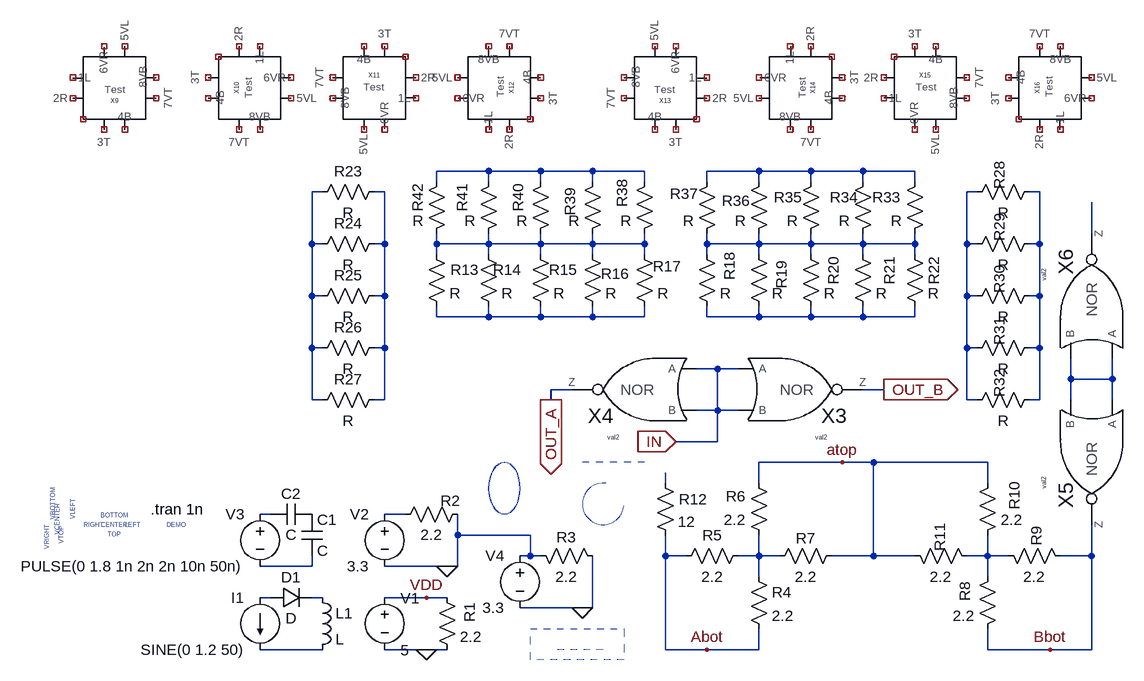
[diagram p0: schematic Draft0.asc]
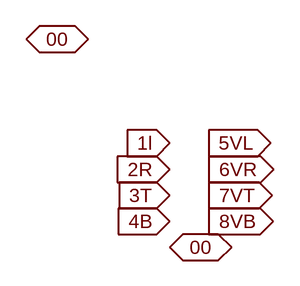
[diagram p1: sub-circuit test.asc]
Draft0.asc, the LTspice schematic file:
Version 4.1
SHEET 1 1832 680
WIRE 848 -144 768 -144
WIRE 928 -144 848 -144
WIRE 1008 -144 928 -144
WIRE 1088 -144 1008 -144
WIRE 1264 -144 1184 -144
WIRE 1344 -144 1264 -144
WIRE 1424 -144 1344 -144
WIRE 1504 -144 1424 -144
WIRE 768 -128 768 -144
WIRE 848 -128 848 -144
WIRE 928 -128 928 -144
WIRE 1008 -128 1008 -144
WIRE 1088 -128 1088 -144
WIRE 1184 -128 1184 -144
WIRE 1264 -128 1264 -144
WIRE 1344 -128 1344 -144
WIRE 1424 -128 1424 -144
WIRE 1504 -128 1504 -144
WIRE 592 -112 576 -112
WIRE 688 -112 672 -112
WIRE 1600 -112 1584 -112
WIRE 1696 -112 1680 -112
WIRE 1776 -48 1776 -96
WIRE 576 -32 576 -112
WIRE 592 -32 576 -32
WIRE 688 -32 688 -112
WIRE 688 -32 672 -32
WIRE 768 -32 768 -48
WIRE 848 -32 848 -48
WIRE 848 -32 768 -32
WIRE 928 -32 928 -48
WIRE 928 -32 848 -32
WIRE 1008 -32 1008 -48
WIRE 1008 -32 928 -32
WIRE 1088 -32 1088 -48
WIRE 1088 -32 1008 -32
WIRE 1184 -32 1184 -48
WIRE 1264 -32 1264 -48
WIRE 1264 -32 1184 -32
WIRE 1344 -32 1344 -48
WIRE 1344 -32 1264 -32
WIRE 1424 -32 1424 -48
WIRE 1424 -32 1344 -32
WIRE 1504 -32 1504 -48
WIRE 1504 -32 1424 -32
WIRE 1584 -32 1584 -112
WIRE 1600 -32 1584 -32
WIRE 1696 -32 1696 -112
WIRE 1696 -32 1680 -32
WIRE 768 -16 768 -32
WIRE 848 -16 848 -32
WIRE 928 -16 928 -32
WIRE 1008 -16 1008 -32
WIRE 1088 -16 1088 -32
WIRE 1184 -16 1184 -32
WIRE 1264 -16 1264 -32
WIRE 1344 -16 1344 -32
WIRE 1424 -16 1424 -32
WIRE 1504 -16 1504 -32
WIRE 576 48 576 -32
WIRE 592 48 576 48
WIRE 688 48 688 -32
WIRE 688 48 672 48
WIRE 1584 48 1584 -32
WIRE 1600 48 1584 48
WIRE 1696 48 1696 -32
WIRE 1696 48 1680 48
WIRE 768 80 768 64
WIRE 848 80 848 64
WIRE 848 80 768 80
WIRE 928 80 928 64
WIRE 928 80 848 80
WIRE 1008 80 1008 64
WIRE 1008 80 928 80
WIRE 1088 80 1088 64
WIRE 1088 80 1008 80
WIRE 1184 80 1184 64
WIRE 1264 80 1264 64
WIRE 1264 80 1184 80
WIRE 1344 80 1344 64
WIRE 1344 80 1264 80
WIRE 1424 80 1424 64
WIRE 1424 80 1344 80
WIRE 1504 80 1504 64
WIRE 1504 80 1424 80
WIRE 576 128 576 48
WIRE 592 128 576 128
WIRE 688 128 688 48
WIRE 688 128 672 128
WIRE 1584 128 1584 48
WIRE 1600 128 1584 128
WIRE 1696 128 1696 48
WIRE 1696 128 1680 128
WIRE 1200 160 1168 160
WIRE 1232 160 1200 160
WIRE 1744 176 1744 144
WIRE 1808 176 1808 144
WIRE 1808 176 1744 176
WIRE 976 192 944 192
WIRE 1456 192 1424 192
WIRE 576 208 576 128
WIRE 592 208 576 208
WIRE 688 208 688 128
WIRE 688 208 672 208
WIRE 944 208 944 192
WIRE 1584 208 1584 128
WIRE 1600 208 1584 208
WIRE 1696 208 1696 128
WIRE 1696 208 1680 208
WIRE 1744 208 1744 176
WIRE 1808 208 1808 176
WIRE 1200 224 1200 160
WIRE 1200 224 1168 224
WIRE 1232 224 1200 224
WIRE 1200 272 1200 224
WIRE 1200 272 1136 272
WIRE 1392 304 1264 304
WIRE 1440 304 1392 304
WIRE 1616 304 1440 304
WIRE 1120 336 1120 320
WIRE 1264 336 1264 304
WIRE 1616 336 1616 304
WIRE 512 384 496 384
WIRE 720 384 688 384
WIRE 800 416 800 384
WIRE 912 416 800 416
WIRE 912 448 912 416
WIRE 912 448 896 448
WIRE 928 448 912 448
WIRE 1120 448 1120 416
WIRE 1152 448 1120 448
WIRE 1264 448 1264 416
WIRE 1264 448 1232 448
WIRE 1296 448 1264 448
WIRE 1440 448 1440 304
WIRE 1440 448 1376 448
WIRE 1504 448 1440 448
WIRE 1616 448 1616 416
WIRE 1616 448 1584 448
WIRE 1648 448 1616 448
WIRE 1776 448 1776 400
WIRE 1776 448 1728 448
WIRE 576 464 576 448
WIRE 576 464 496 464
WIRE 784 464 688 464
WIRE 800 464 800 416
WIRE 800 464 784 464
WIRE 1264 480 1264 448
WIRE 1616 480 1616 448
WIRE 512 512 496 512
WIRE 592 512 576 512
WIRE 752 512 688 512
WIRE 784 512 752 512
WIRE 992 528 896 528
WIRE 1008 528 1008 448
WIRE 1008 528 992 528
WIRE 592 592 496 592
WIRE 752 592 688 592
WIRE 784 592 752 592
WIRE 1120 592 1120 448
WIRE 1184 592 1120 592
WIRE 1264 592 1264 560
WIRE 1264 592 1184 592
WIRE 1616 592 1616 560
WIRE 1712 592 1616 592
WIRE 1776 592 1776 448
WIRE 1776 592 1712 592
FLAG 752 512 VDD
FLAG 752 592 0
FLAG 784 464 0
FLAG 992 528 0
FLAG 1392 304 atop
FLAG 1184 592 Abot
FLAG 1712 592 Bbot
FLAG 944 208 OUT_A
IOPIN 944 208 Out
FLAG 1136 272 IN
IOPIN 1136 272 In
FLAG 1456 192 OUT_B
IOPIN 1456 192 Out
SYMBOL voltage 688 496 R0
WINDOW 0 24 17 Left 2
WINDOW 3 24 97 Left 2
SYMATTR InstName V1
SYMATTR Value 5
SYMBOL res 768 496 R0
WINDOW 0 51 39 VCenter 2
SYMATTR InstName R1
SYMATTR Value 2.2
SYMBOL voltage 688 368 M0
SYMATTR InstName V2
SYMATTR Value 3.3
SYMBOL res 704 400 R270
WINDOW 0 21 85 VTop 2
WINDOW 3 0 56 VBottom 2
SYMATTR InstName R2
SYMATTR Value 2.2
SYMBOL voltage 496 368 M0
WINDOW 123 0 0 Left 0
WINDOW 39 0 0 Left 0
SYMATTR InstName V3
SYMATTR Value PULSE(0 1.8 1n 2n 2n 10n 50n)
SYMBOL cap 560 384 R0
SYMATTR InstName C1
SYMBOL ind 576 496 R0
SYMATTR InstName L1
SYMBOL diode 512 528 R270
WINDOW 0 32 32 VTop 2
WINDOW 3 0 32 VBottom 2
SYMATTR InstName D1
SYMBOL current 496 512 M0
WINDOW 123 0 0 VLeft 0
WINDOW 39 0 0 Left 0
SYMATTR InstName I1
SYMATTR Value SINE(0 1.2 50)
SYMBOL cap 576 368 R90
WINDOW 0 0 32 VBottom 2
WINDOW 3 32 32 VTop 2
SYMATTR InstName C2
SYMBOL voltage 896 432 M0
SYMATTR InstName V4
SYMATTR Value 3.3
SYMBOL res 1024 464 M270
WINDOW 0 45 56 VCenter 2
WINDOW 3 0 56 VBottom 2
SYMATTR InstName R3
SYMATTR Value 2.2
SYMBOL res 1248 464 R0
SYMATTR InstName R4
SYMATTR Value 2.2
SYMBOL res 1248 432 R90
WINDOW 0 0 56 VBottom 2
WINDOW 3 32 56 VTop 2
SYMATTR InstName R5
SYMATTR Value 2.2
SYMBOL res 1280 432 R180
WINDOW 0 36 76 Left 2
WINDOW 3 36 40 Left 2
SYMATTR InstName R6
SYMATTR Value 2.2
SYMBOL res 1280 464 R270
WINDOW 0 59 56 VBottom 2
WINDOW 3 0 56 VBottom 2
SYMATTR InstName R7
SYMATTR Value 2.2
SYMBOL res 1632 464 M0
WINDOW 0 51 24 VRight 2
SYMATTR InstName R8
SYMATTR Value 2.2
SYMBOL res 1632 432 M90
WINDOW 0 -14 43 Top 2
WINDOW 3 32 56 VTop 2
SYMATTR InstName R9
SYMATTR Value 2.2
SYMBOL res 1600 432 M180
WINDOW 0 57 55 VRight 2
WINDOW 3 36 40 Left 2
SYMATTR InstName R10
SYMATTR Value 2.2
SYMBOL res 1600 464 M270
WINDOW 0 45 42 Top 2
WINDOW 3 0 56 VBottom 2
SYMATTR InstName R11
SYMATTR Value 2.2
SYMBOL NOR 1152 224 R0
SYMATTR InstName X3
SYMBOL NOR 1248 224 M0
SYMATTR InstName X4
SYMBOL NOR 1744 128 R90
SYMATTR InstName X5
SYMBOL NOR 1744 224 M270
SYMATTR InstName X6
SYMBOL res 1104 320 R0
WINDOW 0 37 41 Left 2
WINDOW 3 35 75 Left 2
SYMATTR InstName R12
SYMATTR Value 12
SYMBOL res 752 -32 R0
WINDOW 0 37 40 Left 2
SYMATTR InstName R13
SYMBOL res 832 -32 R0
WINDOW 0 67 40 Right 2
SYMATTR InstName R14
SYMBOL res 912 -32 R0
WINDOW 0 51 40 Center 2
SYMATTR InstName R15
SYMBOL res 992 -32 R0
WINDOW 0 51 30 Top 2
SYMATTR InstName R16
SYMBOL res 1072 -32 R0
WINDOW 0 51 50 Bottom 2
SYMATTR InstName R17
SYMBOL res 1168 -32 R0
WINDOW 0 51 56 VLeft 2
SYMATTR InstName R18
SYMBOL res 1248 -32 R0
WINDOW 0 51 25 VRight 2
SYMATTR InstName R19
SYMBOL res 1328 -32 R0
WINDOW 0 51 41 VCenter 2
SYMATTR InstName R20
SYMBOL res 1408 -32 R0
WINDOW 0 41 41 VTop 2
SYMATTR InstName R21
SYMBOL res 1488 -32 R0
WINDOW 0 61 41 VBottom 2
SYMATTR InstName R22
SYMBOL res 688 -128 R90
WINDOW 0 0 56 VBottom 2
WINDOW 3 32 56 VTop 2
SYMATTR InstName R23
SYMBOL res 688 -48 R90
WINDOW 0 0 56 VBottom 2
WINDOW 3 32 56 VTop 2
SYMATTR InstName R24
SYMBOL res 688 32 R90
WINDOW 0 0 56 VBottom 2
WINDOW 3 32 56 VTop 2
SYMATTR InstName R25
SYMBOL res 688 112 R90
WINDOW 0 0 56 VBottom 2
WINDOW 3 32 56 VTop 2
SYMATTR InstName R26
SYMBOL res 688 192 R90
WINDOW 0 0 56 VBottom 2
WINDOW 3 32 56 VTop 2
SYMATTR InstName R27
SYMBOL res 1696 -128 R90
WINDOW 0 -10 46 Top 2
WINDOW 3 32 56 VTop 2
SYMATTR InstName R28
SYMBOL res 1696 -48 R90
WINDOW 0 -10 46 Top 2
WINDOW 3 32 56 VTop 2
SYMATTR InstName R29
SYMBOL res 1696 32 R90
WINDOW 0 -10 46 Top 2
WINDOW 3 32 56 VTop 2
SYMATTR InstName R30
SYMBOL res 1696 112 R90
WINDOW 0 -10 46 Top 2
WINDOW 3 32 56 VTop 2
SYMATTR InstName R31
SYMBOL res 1696 192 R90
WINDOW 0 -10 46 Top 2
WINDOW 3 32 56 VTop 2
SYMATTR InstName R32
SYMBOL res 1520 -144 M0
WINDOW 0 37 40 Left 2
SYMATTR InstName R33
SYMBOL res 1440 -144 M0
WINDOW 0 67 40 Right 2
SYMATTR InstName R34
SYMBOL res 1360 -144 M0
WINDOW 0 51 40 Center 2
SYMATTR InstName R35
SYMBOL res 1280 -144 M0
WINDOW 0 51 30 Top 2
SYMATTR InstName R36
SYMBOL res 1200 -144 M0
WINDOW 0 51 50 Bottom 2
SYMATTR InstName R37
SYMBOL res 1104 -144 M0
WINDOW 0 51 56 VLeft 2
SYMATTR InstName R38
SYMBOL res 1024 -144 M0
WINDOW 0 51 25 VRight 2
SYMATTR InstName R39
SYMBOL res 944 -144 M0
WINDOW 0 51 41 VCenter 2
SYMATTR InstName R40
SYMBOL res 864 -144 M0
WINDOW 0 41 41 VTop 2
SYMATTR InstName R41
SYMBOL res 784 -144 M0
WINDOW 0 61 41 VBottom 2
SYMATTR InstName R42
SYMBOL test 272 -288 R0
SYMATTR InstName X9
SYMBOL test 496 -272 R90
SYMATTR InstName X10
SYMBOL test 672 -256 R180
SYMATTR InstName X11
SYMBOL test 848 -272 R270
SYMATTR InstName X12
SYMBOL test 1120 -288 M0
SYMATTR InstName X13
SYMBOL test 1312 -272 M90
SYMATTR InstName X14
SYMBOL test 1520 -256 M180
SYMATTR InstName X15
SYMBOL test 1728 -272 M270
SYMATTR InstName X16
TEXT 352 400 Left 0 ;DEMO
TEXT 328 376 Left 2 !.tran 1n
TEXT 288 400 Left 0 ;LEFT
TEXT 272 392 Bottom 0 ;BOTTOM
TEXT 256 400 Right 0 ;RIGHT
TEXT 272 408 Top 0 ;TOP
TEXT 272 400 Center 0 ;CENTER
TEXT 208 392 VLeft 0 ;VLEFT
TEXT 184 368 VBottom 0 ;VBOTTOM
TEXT 168 400 VRight 0 ;VRIGHT
TEXT 184 416 VTop 0 ;VTOP
TEXT 184 392 VCenter 0 ;VCENTER
LINE Normal 1088 304 992 304 2
LINE Normal 1024 592 944 592 3
RECTANGLE Normal 1056 608 912 560 4
CIRCLE Normal 896 384 848 304
ARC Normal 992 336 1056 400 1029 333 1062 371 1

test.asc, the sub-circuit schematic file:
Version 4.1
SHEET 1 880 680
FLAG 176 128 1l
IOPIN 176 128 In
FLAG 176 160 2R
IOPIN 176 160 In
FLAG 176 192 3T
IOPIN 176 192 In
FLAG 176 224 4B
IOPIN 176 224 In
FLAG 224 128 5VL
IOPIN 224 128 Out
FLAG 224 160 6VR
IOPIN 224 160 Out
FLAG 224 192 7VT
IOPIN 224 192 Out
FLAG 224 224 8VB
IOPIN 224 224 Out
FLAG 176 256 00
IOPIN 176 256 BiDir
FLAG 0 0 00
IOPIN 0 0 BiDir

The netlist it stands for:
* Draft0.asc
V1 VDD 0 5
R1 VDD 0 2.2
V2 N015 0 3.3
R2 N015 0 2.2
V3 N014 N018 PULSE(0 1.8 1n 2n 2n 10n 50n)
C1 P001 N018 C
L1 N020 N021 L
D1 N019 N020 D
I1 N019 N021 SINE(0 1.2 50)
C2 P001 N014 C
V4 0 0 3.3
R3 0 0 2.2
R4 N016 Abot 2.2
R5 N016 Abot 2.2
R6 N016 atop 2.2
R7 N016 atop 2.2
R8 N017 Bbot 2.2
R9 N017 Bbot 2.2
R10 N017 atop 2.2
R11 N017 atop 2.2
X§X3 OUT_B IN IN val2  ; pins Z B A
X§X4 OUT_A IN IN val2  ; pins Z B A
X§X5 Bbot N012 N012 val2  ; pins Z B A
X§X6 N007 N012 N012 val2  ; pins Z B A
R12 N013 Abot 12
R13 N008 N010 R
R14 N008 N010 R
R15 N008 N010 R
R16 N008 N010 R
R17 N008 N010 R
R18 N009 N011 R
R19 N009 N011 R
R20 N009 N011 R
R21 N009 N011 R
R22 N009 N011 R
R23 N004 N003 R
R24 N004 N003 R
R25 N004 N003 R
R26 N004 N003 R
R27 N004 N003 R
R28 N006 N005 R
R29 N006 N005 R
R30 N006 N005 R
R31 N006 N005 R
R32 N006 N005 R
R33 N002 N009 R
R34 N002 N009 R
R35 N002 N009 R
R36 N002 N009 R
R37 N002 N009 R
R38 N001 N008 R
R39 N001 N008 R
R40 N001 N008 R
R41 N001 N008 R
R42 N001 N008 R
X§X9 NC_01 NC_02 NC_03 NC_04 NC_05 NC_06 NC_07 NC_08 NC_09 test
X§X10 NC_10 NC_11 NC_12 NC_13 NC_14 NC_15 NC_16 NC_17 NC_18 test
X§X11 NC_19 NC_20 NC_21 NC_22 NC_23 NC_24 NC_25 NC_26 NC_27 test
X§X12 NC_28 NC_29 NC_30 NC_31 NC_32 NC_33 NC_34 NC_35 NC_36 test
X§X13 NC_37 NC_38 NC_39 NC_40 NC_41 NC_42 NC_43 NC_44 NC_45 test
X§X14 NC_46 NC_47 NC_48 NC_49 NC_50 NC_51 NC_52 NC_53 NC_54 test
X§X15 NC_55 NC_56 NC_57 NC_58 NC_59 NC_60 NC_61 NC_62 NC_63 test
X§X16 NC_64 NC_65 NC_66 NC_67 NC_68 NC_69 NC_70 NC_71 NC_72 test

* block symbol definitions
.subckt test 1L 2R 3T 4B 5VL 6VR 7VT 8VB 00
.ends test

.model D D
.lib standard.dio
* DEMO
.tran 1n
* LEFT
* BOTTOM
* RIGHT
* TOP
* CENTER
* VLEFT
* VBOTTOM
* VRIGHT
* VTOP
* VCENTER
.lib mymodel
.backanno
.end